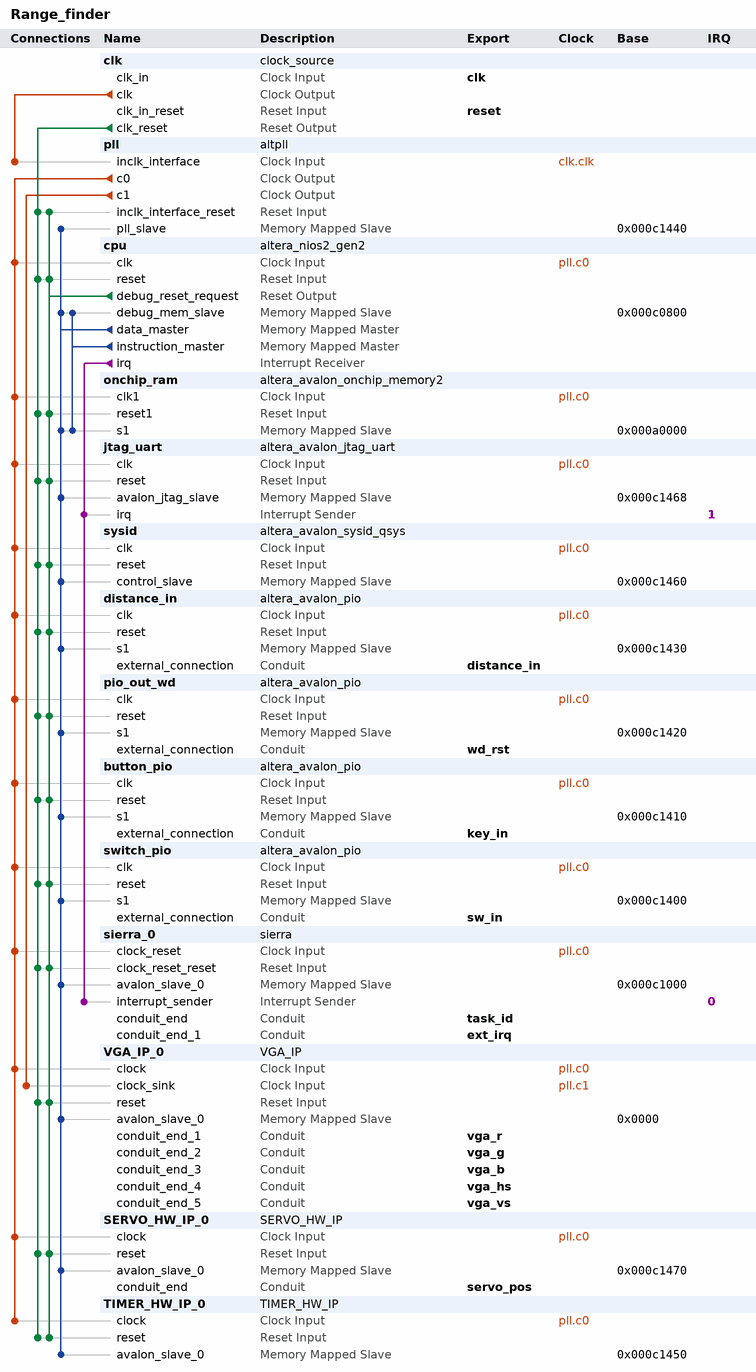
[diagram p0: system contents]
# Platform Designer (Qsys) system Range_finder, MAX 10 10M50DAF484C7G
# Parameters at their usual value, and those the tool derives, are not listed.
package require -exact qsys 18.1
create_system Range_finder
set_project_property DEVICE_FAMILY {MAX 10}
set_project_property DEVICE 10M50DAF484C7G

add_instance clk clock_source 18.1
set_instance_parameter_value clk clockFrequency 50000000

add_instance pll altpll 18.1
set_instance_parameter_value pll CLK0_DIVIDE_BY 1
set_instance_parameter_value pll CLK0_MULTIPLY_BY 1
set_instance_parameter_value pll CLK1_DIVIDE_BY 2
set_instance_parameter_value pll CLK1_DUTY_CYCLE 50
set_instance_parameter_value pll CLK1_MULTIPLY_BY 1
set_instance_parameter_value pll CLK1_PHASE_SHIFT 0
set_instance_parameter_value pll INCLK0_INPUT_FREQUENCY 20000
set_instance_parameter_value pll PORT_ARESET PORT_UNUSED
set_instance_parameter_value pll PORT_LOCKED PORT_UNUSED
set_instance_parameter_value pll PORT_clk1 PORT_USED
set_instance_parameter_value pll PORT_clk2 PORT_UNUSED
set_instance_parameter_value pll PORT_clk3 PORT_UNUSED

add_instance cpu altera_nios2_gen2 18.1
set_instance_parameter_value cpu dcache_size 2048
set_instance_parameter_value cpu exceptionSlave onchip_ram.s1
set_instance_parameter_value cpu icache_size 4096
set_instance_parameter_value cpu impl Tiny
set_instance_parameter_value cpu resetSlave onchip_ram.s1

add_instance onchip_ram altera_avalon_onchip_memory2 18.1
set_instance_parameter_value onchip_ram dataWidth 32
set_instance_parameter_value onchip_ram dualPort false
set_instance_parameter_value onchip_ram initMemContent false
set_instance_parameter_value onchip_ram initializationFileName onchip_mem.hex
set_instance_parameter_value onchip_ram memorySize 131072

add_instance jtag_uart altera_avalon_jtag_uart 18.1
set_instance_parameter_value jtag_uart simInteractiveOptions NO_INTERACTIVE_WINDOWS

add_instance sysid altera_avalon_sysid_qsys 18.1
set_instance_parameter_value sysid id 0

add_instance distance_in altera_avalon_pio 18.1
set_instance_parameter_value distance_in direction Input
set_instance_parameter_value distance_in width 9

add_instance pio_out_wd altera_avalon_pio 18.1
set_instance_parameter_value pio_out_wd direction Output
set_instance_parameter_value pio_out_wd width 1

add_instance button_pio altera_avalon_pio 18.1
set_instance_parameter_value button_pio direction Input
set_instance_parameter_value button_pio width 2

add_instance switch_pio altera_avalon_pio 18.1
set_instance_parameter_value switch_pio direction Input
set_instance_parameter_value switch_pio width 8

add_instance sierra_0 sierra 9.4.2

add_instance VGA_IP_0 VGA_IP 1.0

add_instance SERVO_HW_IP_0 SERVO_HW_IP 1.0

add_instance TIMER_HW_IP_0 TIMER_HW_IP 1.0

# connections
add_connection clk.clk pll.inclk_interface clock
add_connection pll.c0 button_pio.clk clock
add_connection pll.c0 cpu.clk clock
add_connection pll.c0 distance_in.clk clock
add_connection pll.c0 jtag_uart.clk clock
add_connection pll.c0 onchip_ram.clk1 clock
add_connection pll.c0 pio_out_wd.clk clock
add_connection pll.c0 SERVO_HW_IP_0.clock clock
add_connection pll.c0 sierra_0.clock_reset clock
add_connection pll.c0 switch_pio.clk clock
add_connection pll.c0 sysid.clk clock
add_connection pll.c0 TIMER_HW_IP_0.clock clock
add_connection pll.c0 VGA_IP_0.clock clock
add_connection pll.c1 VGA_IP_0.clock_sink clock
add_connection clk.clk_reset button_pio.reset reset
add_connection clk.clk_reset cpu.reset reset
add_connection clk.clk_reset distance_in.reset reset
add_connection clk.clk_reset jtag_uart.reset reset
add_connection clk.clk_reset onchip_ram.reset1 reset
add_connection clk.clk_reset pio_out_wd.reset reset
add_connection clk.clk_reset pll.inclk_interface_reset reset
add_connection clk.clk_reset SERVO_HW_IP_0.reset reset
add_connection clk.clk_reset sierra_0.clock_reset_reset reset
add_connection clk.clk_reset switch_pio.reset reset
add_connection clk.clk_reset sysid.reset reset
add_connection clk.clk_reset TIMER_HW_IP_0.reset reset
add_connection clk.clk_reset VGA_IP_0.reset reset
add_connection cpu.debug_reset_request button_pio.reset reset
add_connection cpu.debug_reset_request cpu.reset reset
add_connection cpu.debug_reset_request distance_in.reset reset
add_connection cpu.debug_reset_request jtag_uart.reset reset
add_connection cpu.debug_reset_request onchip_ram.reset1 reset
add_connection cpu.debug_reset_request pio_out_wd.reset reset
add_connection cpu.debug_reset_request pll.inclk_interface_reset reset
add_connection cpu.debug_reset_request SERVO_HW_IP_0.reset reset
add_connection cpu.debug_reset_request sierra_0.clock_reset_reset reset
add_connection cpu.debug_reset_request switch_pio.reset reset
add_connection cpu.debug_reset_request sysid.reset reset
add_connection cpu.debug_reset_request TIMER_HW_IP_0.reset reset
add_connection cpu.debug_reset_request VGA_IP_0.reset reset
add_connection cpu.data_master button_pio.s1 avalon
set_connection_parameter_value cpu.data_master/button_pio.s1 baseAddress 0x000c1410
add_connection cpu.data_master cpu.debug_mem_slave avalon
set_connection_parameter_value cpu.data_master/cpu.debug_mem_slave baseAddress 0x000c0800
add_connection cpu.data_master distance_in.s1 avalon
set_connection_parameter_value cpu.data_master/distance_in.s1 baseAddress 0x000c1430
add_connection cpu.data_master jtag_uart.avalon_jtag_slave avalon
set_connection_parameter_value cpu.data_master/jtag_uart.avalon_jtag_slave baseAddress 0x000c1468
add_connection cpu.data_master onchip_ram.s1 avalon
set_connection_parameter_value cpu.data_master/onchip_ram.s1 baseAddress 0x000a0000
add_connection cpu.data_master pio_out_wd.s1 avalon
set_connection_parameter_value cpu.data_master/pio_out_wd.s1 baseAddress 0x000c1420
add_connection cpu.data_master pll.pll_slave avalon
set_connection_parameter_value cpu.data_master/pll.pll_slave baseAddress 0x000c1440
add_connection cpu.data_master SERVO_HW_IP_0.avalon_slave_0 avalon
set_connection_parameter_value cpu.data_master/SERVO_HW_IP_0.avalon_slave_0 baseAddress 0x000c1470
add_connection cpu.data_master sierra_0.avalon_slave_0 avalon
set_connection_parameter_value cpu.data_master/sierra_0.avalon_slave_0 baseAddress 0x000c1000
add_connection cpu.data_master switch_pio.s1 avalon
set_connection_parameter_value cpu.data_master/switch_pio.s1 baseAddress 0x000c1400
add_connection cpu.data_master sysid.control_slave avalon
set_connection_parameter_value cpu.data_master/sysid.control_slave baseAddress 0x000c1460
add_connection cpu.data_master TIMER_HW_IP_0.avalon_slave_0 avalon
set_connection_parameter_value cpu.data_master/TIMER_HW_IP_0.avalon_slave_0 baseAddress 0x000c1450
add_connection cpu.data_master VGA_IP_0.avalon_slave_0 avalon
set_connection_parameter_value cpu.data_master/VGA_IP_0.avalon_slave_0 baseAddress 0x0000
add_connection cpu.instruction_master cpu.debug_mem_slave avalon
set_connection_parameter_value cpu.instruction_master/cpu.debug_mem_slave baseAddress 0x000c0800
add_connection cpu.instruction_master onchip_ram.s1 avalon
set_connection_parameter_value cpu.instruction_master/onchip_ram.s1 baseAddress 0x000a0000
add_connection cpu.irq jtag_uart.irq interrupt
set_connection_parameter_value cpu.irq/jtag_uart.irq irqNumber 1
add_connection cpu.irq sierra_0.interrupt_sender interrupt
set_connection_parameter_value cpu.irq/sierra_0.interrupt_sender irqNumber 0

# exported interfaces
add_interface clk clock sink
set_interface_property clk EXPORT_OF clk.clk_in
add_interface distance_in conduit end
set_interface_property distance_in EXPORT_OF distance_in.external_connection
add_interface ext_irq conduit end
set_interface_property ext_irq EXPORT_OF sierra_0.conduit_end_1
add_interface key_in conduit end
set_interface_property key_in EXPORT_OF button_pio.external_connection
add_interface reset reset sink
set_interface_property reset EXPORT_OF clk.clk_in_reset
add_interface servo_pos conduit end
set_interface_property servo_pos EXPORT_OF SERVO_HW_IP_0.conduit_end
add_interface sw_in conduit end
set_interface_property sw_in EXPORT_OF switch_pio.external_connection
add_interface task_id conduit end
set_interface_property task_id EXPORT_OF sierra_0.conduit_end
add_interface vga_b conduit end
set_interface_property vga_b EXPORT_OF VGA_IP_0.conduit_end_3
add_interface vga_g conduit end
set_interface_property vga_g EXPORT_OF VGA_IP_0.conduit_end_2
add_interface vga_hs conduit end
set_interface_property vga_hs EXPORT_OF VGA_IP_0.conduit_end_4
add_interface vga_r conduit end
set_interface_property vga_r EXPORT_OF VGA_IP_0.conduit_end_1
add_interface vga_vs conduit end
set_interface_property vga_vs EXPORT_OF VGA_IP_0.conduit_end_5
add_interface wd_rst conduit end
set_interface_property wd_rst EXPORT_OF pio_out_wd.external_connection

set_interconnect_requirement {$system} qsys_mm.clockCrossingAdapter HANDSHAKE
set_interconnect_requirement {$system} qsys_mm.enableEccProtection FALSE
set_interconnect_requirement {$system} qsys_mm.insertDefaultSlave FALSE
set_interconnect_requirement {$system} qsys_mm.maxAdditionalLatency 1

save_system Range_finder.qsys
